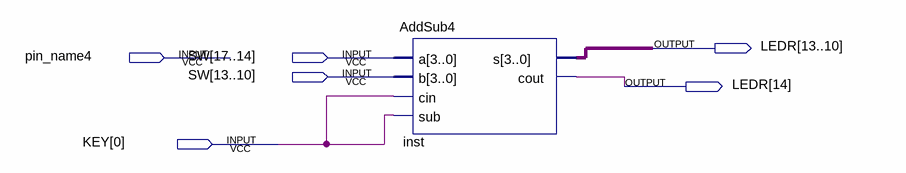
[diagram p0: schematic sheet]
// Quartus schematic AdderDemo.bdf as structural Verilog: 1 symbols, 6 pins
module AdderDemo (
  input  pin_name4,
  input  [17:10] SW,
  input  [0:0] KEY,
  output [14:10] LEDR
);

  AddSub4 inst (.a(SW[17:14]), .b(SW[13:10]), .cin(KEY[0]), .sub(KEY[0]), .s(LEDR[13:10]), .cout(LEDR[14]));
endmodule
